# Altium schematic sheet PDM-S10-V00-SDCard.SchDoc: SD Card
size A3; DrawnBy: Zoe Goodward; Organization: QUT Motorsport; Address1: O-120, Gardens Point; Address2: 2 George Street; Address3: Brisbane, QLD 4000; Address4: Australia; DocumentNumber: ####; Revision: 01; SheetNumber: 1; SheetTotal: 1; Version: 01; Project: Power Distribution Module; PageSetup: Record=PageOptions|CenterHorizontal=True|CenterVertical=True|PrintScale=0.97|XCorrection=1.00|YCorrection=1.00|PrintKind=0|BorderSize=5000000|LeftOffset=0|BottomOffset=0|Orientation=2|PaperLength=1000|PaperWidth=1000|Scale=100|PaperSource=7|PrintQuality=-4|MediaType=1|DitherType=10|PaperKind=A4|PrintScaleMode=1
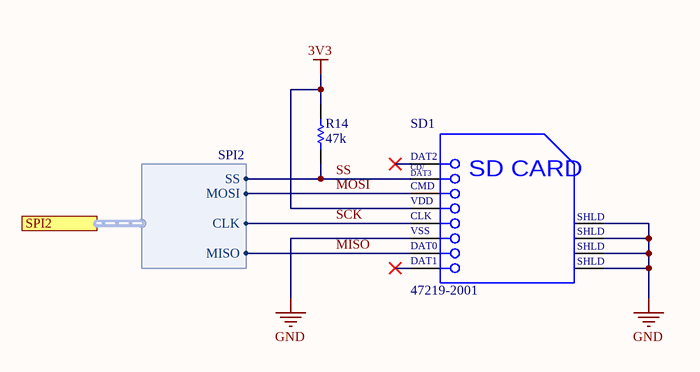
[diagram p0: PDM-S10-V00-SDCard.SchDoc]

## Parts
R14  47k  [Res_ThinFilm_0603]
SD1  47219-2001  [MOLX-47219-2001-8_V]

## Ports
SPI2 (harness SPI2)

## Harnesses
SPI2: SS, MOSI, CLK, MISO

## Nets
3V3: R14.2 SD1.4(VDD)
GND: SD1.6(VSS) SD1.9(SHLD) SD1.10(SHLD) SD1.11(SHLD) SD1.12(SHLD)
MISO: SD1.7(DAT0) ; port SPI2.MISO
MOSI: SD1.3(CMD) ; port SPI2.MOSI
SCK: SD1.5(CLK) ; port SPI2.CLK
SS: R14.1 SD1.2(CD/DAT3) ; port SPI2.SS

Not connected (* = marked no-connect by the designer): SD1 1(DAT2)* 8(DAT1)*

## Notes on the sheet
- Revision History:
- Sheet Title:
- Rev
- Date
- Description
- Project:
- Size:
- Drawn By:
- A3
- Number:
- Revision:
- Sheet
- Version:
- of
- QUT Motorsport
- O-120, Gardens Point
- 2 George Street
- Brisbane, QLD 4000
- Australia
- Print Date:
- Print Time:
- File Name:
- (in symbol 47219-2001) CD/; DAT3; SD CARD

## Library data of the parts
R14 = 47k 5% 0603: Resistor, SMD, 47k, 0.1W, 5%, 0603
SD1 = 47219-2001: MicroSD Card Connector, Hinge Type, -40 to 85 degC, 8-Pin SMD, RoHS, Tape and Reel; Manufacturer: Molex; Current Rating: 500mA; Number of Contacts: 8; Pitch: 1.09mm; Insertion - Extraction Style: Hinged; Voltage Rating: 100VDC; Product: CardConnectors; Contact Material: CopperAlloy; Series: 47219; Packaging: Reel; Brand: Molex; Product Category: MemoryCardConnectors; Housing Material: Thermoplastic; Mounting Style: SMD/SMT; Termination Style: SMD; Datasheet Version: Rev. F, 06/2009; Card Type: microSD; Manufacturer URL: http://www.molex.com/; RoHS: Details; Datasheet URL: http://www.molex.com/pdm_docs/sd/472192001_sd.pdf; Factory Pack Quantity: 2400